# Altium schematic sheet AD603_AGC.SchDoc
size A4
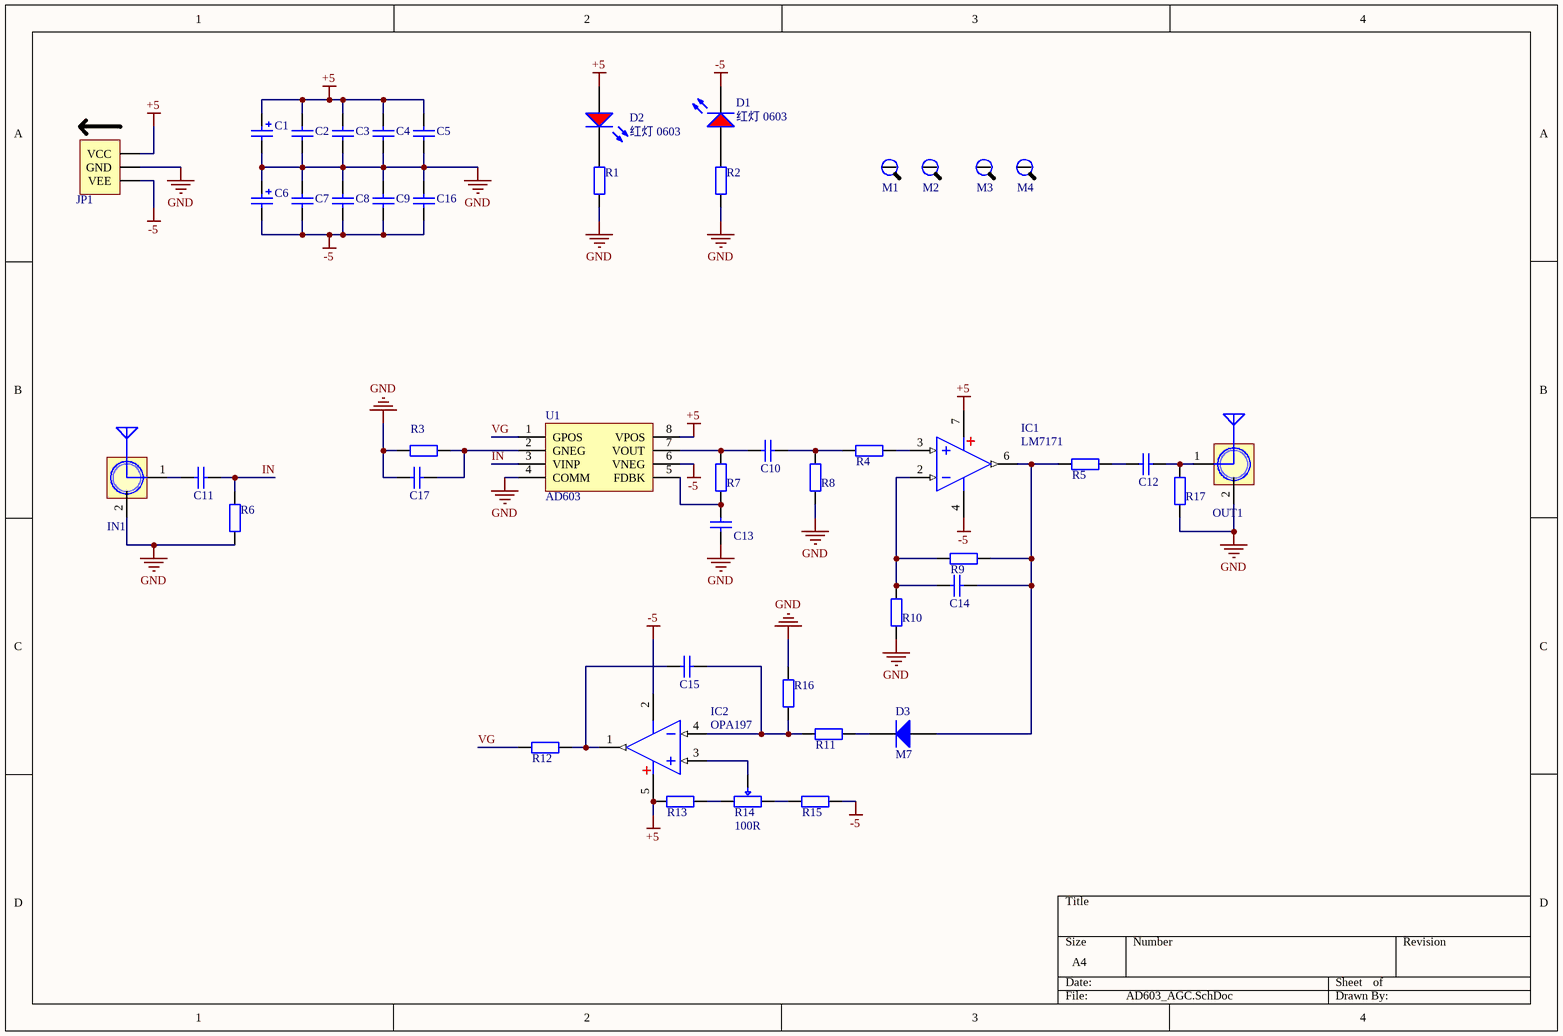
[diagram p0: AD603_AGC.SchDoc]

## Parts
C1  10uF (106) ±10% 16V  [CASE-A_3216]  (value not drawn)
C2  100nF (104) 10% 50V  [0603_C]  (value not drawn)
C3  100nF (104) 10% 50V  [0603_C]  (value not drawn)
C4  100nF (104) 10% 50V  [0603_C]  (value not drawn)
C5  100nF (104) 10% 50V  [0603_C]  (value not drawn)
C6  10uF (106) ±10% 16V  [CASE-A_3216]  (value not drawn)
C7  100nF (104) 10% 50V  [0603_C]  (value not drawn)
C8  100nF (104) 10% 50V  [0603_C]  (value not drawn)
C9  100nF (104) 10% 50V  [0603_C]  (value not drawn)
C10  100nF (104) 10% 50V  [0603_C]  (value not drawn)
C11  100nF (104) 10% 50V  [0603_C]  (value not drawn)
C12  100nF (104) 10% 50V  [0603_C]  (value not drawn)
C13  100nF (104) 10% 50V  [0603_C]  (value not drawn)
C14  100nF (104) 10% 50V  [0603_C]  (value not drawn)
C15  100nF (104) 10% 50V  [0603_C]  (value not drawn)
C16  100nF (104) 10% 50V  [0603_C]  (value not drawn)
C17  100nF (104) 10% 50V  [0603_C]  (value not drawn)
D1  红灯 0603  [0603_LED_S1]
D2  红灯 0603  [0603_LED_S1]
D3  M7  [SMA(DO-214AC)_S1]
IC1  LM7171  [SOP8_N]
IC2  OPA197  [SOT23-5N]
IN1  SMA WIFI 天线接口  [SMA]  (value not drawn)
JP1  HDR-1X3  [Power_IN_3.81-3P]  (value not drawn)
M1  M3  [M3x10_L]  (value not drawn)
M2  M3  [M3x10_L]  (value not drawn)
M3  M3  [M3x10_L]  (value not drawn)
M4  M3  [M3x10_L]  (value not drawn)
OUT1  SMA WIFI 天线接口  [SMA]  (value not drawn)
R1  10KΩ (1002) ±1%  [0603_R]  (value not drawn)
R2  10KΩ (1002) ±1%  [0603_R]  (value not drawn)
R3  10KΩ (1002) ±1%  [0603_R]  (value not drawn)
R4  10KΩ (1002) ±1%  [0603_R]  (value not drawn)
R5  10KΩ (1002) ±1%  [0603_R]  (value not drawn)
R6  10KΩ (1002) ±1%  [0603_R]  (value not drawn)
R7  10KΩ (1002) ±1%  [0603_R]  (value not drawn)
R8  10KΩ (1002) ±1%  [0603_R]  (value not drawn)
R9  10KΩ (1002) ±1%  [0603_R]  (value not drawn)
R10  10KΩ (1002) ±1%  [0603_R]  (value not drawn)
R11  10KΩ (1002) ±1%  [0603_R]  (value not drawn)
R12  10KΩ (1002) ±1%  [0603_R]  (value not drawn)
R13  10KΩ (1002) ±1%  [0603_R]  (value not drawn)
R14  value 100R  [adjustable resistor]  (hidden comment: Ω)
R15  10KΩ (1002) ±1%  [0603_R]  (value not drawn)
R16  10KΩ (1002) ±1%  [0603_R]  (value not drawn)
R17  10KΩ (1002) ±1%  [0603_R]  (value not drawn)
U1  AD603  [SO-8]

## Nets
+5: C1.1 C2.2 C3.2 C4.2 C5.2 D2.A IC1.7(V+) IC2.5(V+) JP1.1(VCC) R13.1 U1.8(VPOS)
-5: C6.2 C7.1 C8.1 C9.1 C16.1 D1.K IC1.4(V-) IC2.2(V-) JP1.3(VEE) R15.2 U1.6(VNEG)
GND: C1.2 C2.1 C3.1 C4.1 C5.1 C6.1 C7.2 C8.2 C9.2 C13.2 C16.2 C17.2 IN1.2 JP1.2(GND) OUT1.2 R1.1 R2.1 R3.2 R6.1 R8.2 R10.2 R16.2 R17.1 U1.4(COMM)
IN: C11.1 R6.2 U1.3(VINP)
VG: R12.1 U1.1(GPOS)
NetC10_1: C10.1 R4.1 R8.1
NetC10_2: C10.2 R7.1 U1.7(VOUT)
NetC11_2: C11.2 IN1.1(SINGLE)
NetC12_1: C12.1 OUT1.1(SINGLE) R17.2
NetC12_2: C12.2 R5.2
NetC13_1: C13.1 R7.2 U1.5(FDBK)
NetC14_1: C14.1 D3.1(A) IC1.6(OUT) R5.1 R9.2
NetC14_2: C14.2 IC1.2(IN-) R9.1 R10.1
NetC15_1: C15.1 IC2.4(IN-) R11.1 R16.1
NetC15_2: C15.2 IC2.1(OUT) R12.2
NetC17_1: C17.1 R3.1 U1.2(GNEG)
NetD1_A: D1.A R2.2
NetD2_K: D2.K R1.2
NetD3_2: D3.2(K) R11.2
NetIC1_3: IC1.3 R4.2
NetIC2_3: IC2.3(IN+) R14.2
NetR13_2: R13.2 R14.1
NetR14_3: R14.3 R15.1

Not connected (* = marked no-connect by the designer): M1 1; M2 1; M3 1; M4 1

## Library data of the parts
C1 C6 = 3216 10uF (106) 10% 16V: 钽电容; ComponentLink1Description: 供应商链接; ComponentLink1URL: http://www.szlcsc.com/product/details_7643.html; Package: 3216; Supplier: LC; SuppliersPartNumber: C7171
C2-C5 C7-C17 = 0603 100nF (104) 10% 50V: 贴片电容; ComponentLink1Description: 供应商链接; ComponentLink1URL: http://www.szlcsc.com/product/details_15331.html; Package: 0603; Supplier: LC; SuppliersPartNumber: C14663
D1 D2 = 0603 红灯: 发光二极管; ComponentLink1Description: 供应商链接; ComponentLink1URL: http://www.szlcsc.com/product/details_2659.html; Package: 0603; Supplier: LC; SuppliersPartNumber: C2286
D3 = SMA(DO-214AC) M7: 二极管; Notepad: 1N4007 4007 编号C2464 已经停售, 使用新物料编号C95872; ComponentLink1Description: 供应商链接; ComponentLink1URL: http://www.szlcsc.com/product/details_2841.html; Package: SMA(DO-214AC); Supplier: LC; SuppliersPartNumber: C95872
IC1 = SGM8521-8Pin: SOP8_轨至轨运放; BOM名称: 轨至轨运放; 版权归属: 源创客; 学习资源: www.ooocke.com
IC2 = SGM8521-5Pin: SOT23-5_轨至轨运放; BOM名称: 轨至轨运放; 版权归属: 源创客; 学习资源: www.ooocke.com
IN1 OUT1 = PORT_SMA: SMA-2.4G射频天线接口; 版权归属: 源创客; BOM名称: SMA-2.4G射频天线接口; 学习资源: www.ooocke.com
JP1 = PORT_Power_IN3: 3P接插件,模块双电源供电口; 版权归属: 源创客; BOM名称: 3P接插件; 学习资源: www.ooocke.com
M1-M4 = ELSE_M3_screw: 螺丝
R1-R13 R15-R17 = 0603 10KΩ (1002) 1%: 贴片电阻; ComponentLink1Description: 供应商链接; ComponentLink1URL: http://www.szlcsc.com/product/details_26547.html; Package: 0603; Supplier: LC; SuppliersPartNumber: C25804
R14 = RES_Adjustable_Resistor: adjustable resistor可调电阻